# EAGLE design connector_16x4 (EAGLE 9.4.2)
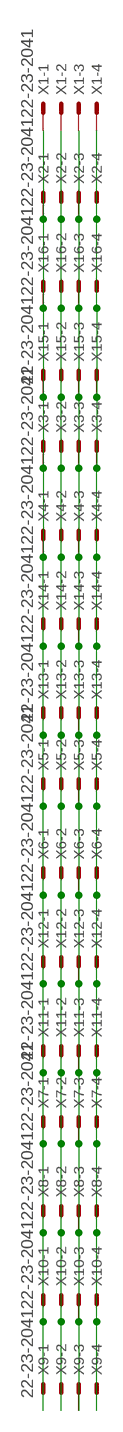
[diagram p0: schematic, sheet 1]

## Parts
X1  22-23-2041  [22-23-2041]
X2  22-23-2041  [22-23-2041]
X3  22-23-2041  [22-23-2041]
X4  22-23-2041  [22-23-2041]
X5  22-23-2041  [22-23-2041]
X6  22-23-2041  [22-23-2041]
X7  22-23-2041  [22-23-2041]
X8  22-23-2041  [22-23-2041]
X9  22-23-2041  [22-23-2041]
X10  22-23-2041  [22-23-2041]
X11  22-23-2041  [22-23-2041]
X12  22-23-2041  [22-23-2041]
X13  22-23-2041  [22-23-2041]
X14  22-23-2041  [22-23-2041]
X15  22-23-2041  [22-23-2041]
X16  22-23-2041  [22-23-2041]

## Nets
N$1: X1.1 X2.1 X3.1 X4.1 X5.1 X6.1 X7.1 X8.1 X9.1 X10.1 X11.1 X12.1 X13.1 X14.1 X15.1 X16.1
N$3: X1.2 X2.2 X3.2 X4.2 X5.2 X6.2 X7.2 X8.2 X9.2 X10.2 X11.2 X12.2 X13.2 X14.2 X15.2 X16.2
N$4: X1.3 X2.3 X3.3 X4.3 X5.3 X6.3 X7.3 X8.3 X9.3 X10.3 X11.3 X12.3 X13.3 X14.3 X15.3 X16.3
N$5: X1.4 X2.4 X3.4 X4.4 X5.4 X6.4 X7.4 X8.4 X9.4 X10.4 X11.4 X12.4 X13.4 X14.4 X15.4 X16.4

## Library data of the parts
X1-X16 = con-molex:22-23-2041: .100" (2.54mm) Center Header - 4 Pin; MF: MOLEX; MPN: 22-23-2041; OC_FARNELL: 1462920; OC_NEWARK: 38C0355

## Board
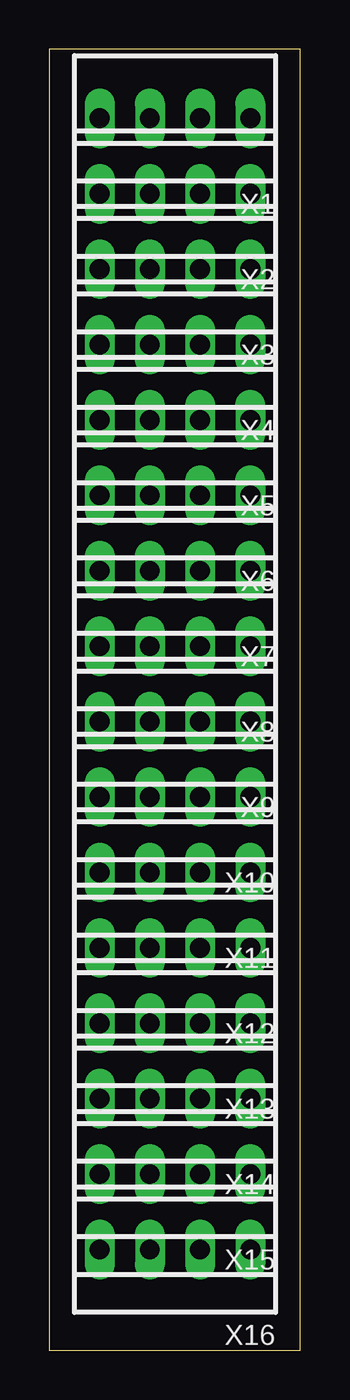
[diagram p1: board, top side]
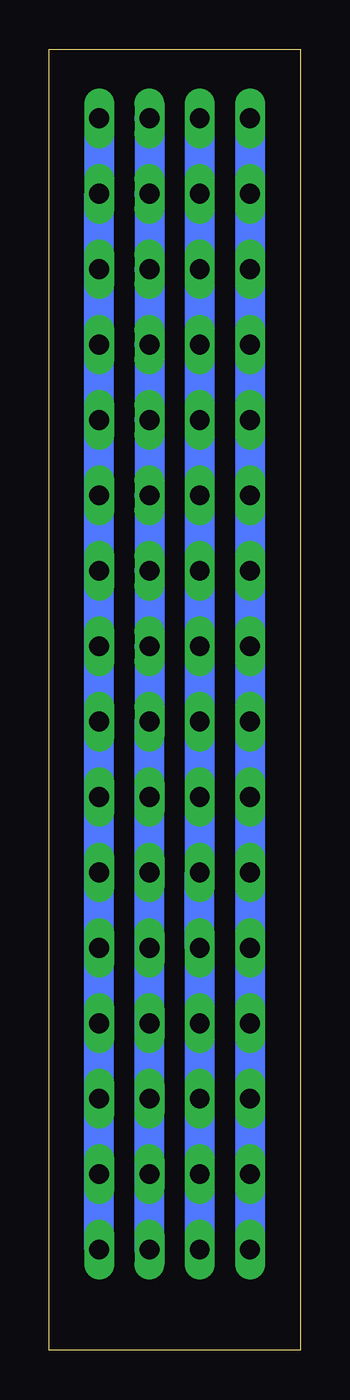
[diagram p2: board, bottom side, seen from below]

Size 12.68 x 65.71 mm. Coordinates in mm from the lower left corner, seen from the top.
Outline: 0,0 12.68,0 12.68,65.71 0,65.71 0,0
Copper layers (1*16): Top 0.035mm / dielectric 1.5mm / Bottom 0.035mm
Design rules "default": minimum track width 6mil, minimum drill 0.35mm, track to track 6mil, track to pad 6mil, pad to pad 6mil, via to via 6mil, smd to smd 6mil, copper to edge 40mil, drill to drill 6mil, minimum pad ring 10mil, minimum via ring 8mil, stop-mask expansion 4mil, vias tented up to drill 0mil, thermal gap 10mil

### Footprints (pad centres in the part's own frame; a part is rotated, then mirrored left to right if it is on the bottom)
22-23-2041 = drill 1 long: 1 -3.81,0; 2 -1.27,0; 3 1.27,0; 4 3.81,0

### Placement (x,y rotation side)
X1  6.35,62.23 180 top
X2  6.35,58.42 180 top
X3  6.35,54.61 180 top
X4  6.35,50.8 180 top
X5  6.35,46.99 180 top
X6  6.35,43.18 180 top
X7  6.35,39.37 180 top
X8  6.35,35.56 180 top
X9  6.35,31.75 180 top
X10  6.35,27.94 180 top
X11  6.35,24.13 180 top
X12  6.35,20.32 180 top
X13  6.35,16.51 180 top
X14  6.35,12.7 180 top
X15  6.35,8.89 180 top
X16  6.35,5.08 180 top

### Tracks (layer width: path | path; a pad name or v marks a point on that pad's centre or on a via)
N$1
  Bottom 1.524: X16.1 X15.1 X14.1 X13.1 X12.1 X11.1 X10.1 X9.1 X8.1 X7.1 X6.1 X5.1 X4.1 X3.1 X2.1 X1.1
N$3
  Bottom 1.524: X16.2 X15.2 X14.2 X13.2 X12.2 X11.2 X10.2 X9.2 X8.2 X7.2 X6.2 X5.2 X4.2 X3.2 X2.2 X1.2
N$4
  Bottom 1.524: X1.3 X2.3 X3.3 X4.3 X5.3 X6.3 X7.3 X8.3 X9.3 X10.3 X11.3 X12.3 X13.3 X14.3 X15.3 X16.3
N$5
  Bottom 1.524: X1.4 X2.4 X3.4 X4.4 X5.4 X6.4 X7.4 X8.4 X9.4 X10.4 X11.4 X12.4 X13.4 X14.4 X15.4 X16.4